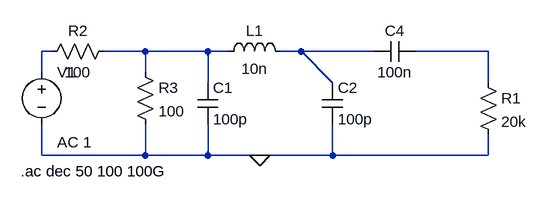
[diagram p0: schematic realim-colpits.asc]
realim-colpits.asc, the LTspice schematic file:
Version 4
SHEET 1 880 680
WIRE -112 64 -128 64
WIRE 32 64 -32 64
WIRE 128 64 32 64
WIRE 160 64 128 64
WIRE 272 64 240 64
WIRE 384 64 272 64
WIRE 560 64 448 64
WIRE -128 96 -128 64
WIRE 32 96 32 64
WIRE 128 112 128 64
WIRE 320 112 272 64
WIRE 560 112 560 64
WIRE -128 224 -128 176
WIRE 32 224 32 176
WIRE 32 224 -128 224
WIRE 128 224 128 176
WIRE 128 224 32 224
WIRE 208 224 128 224
WIRE 320 224 320 176
WIRE 320 224 208 224
WIRE 560 224 560 192
WIRE 560 224 320 224
FLAG 208 224 0
SYMBOL cap 112 112 R0
SYMATTR InstName C1
SYMATTR Value 100p
SYMBOL cap 304 112 R0
SYMATTR InstName C2
SYMATTR Value 100p
SYMBOL ind 144 80 R270
WINDOW 0 32 56 VTop 2
WINDOW 3 5 56 VBottom 2
SYMATTR InstName L1
SYMATTR Value 10n
SYMBOL voltage -128 80 R0
WINDOW 123 24 124 Left 2
WINDOW 39 0 0 Left 0
SYMATTR Value2 AC 1
SYMATTR InstName V1
SYMATTR Value ""
SYMBOL cap 448 48 R90
WINDOW 0 0 32 VBottom 2
WINDOW 3 32 32 VTop 2
SYMATTR InstName C4
SYMATTR Value 100n
SYMBOL res 544 96 R0
SYMATTR InstName R1
SYMATTR Value 20k
SYMBOL res -16 48 R90
WINDOW 0 0 56 VBottom 2
WINDOW 3 32 56 VTop 2
SYMATTR InstName R2
SYMATTR Value 100
SYMBOL res 16 80 R0
SYMATTR InstName R3
SYMATTR Value 100
TEXT -160 248 Left 2 !.ac dec 50 100 100G

The netlist it stands for:
* realim-colpits.asc
C1 N002 0 100p
C2 N003 0 100p
L1 N002 N003 10n
V1 N001 0 AC 1
C4 N004 N003 100n
R1 N004 0 20k
R2 N002 N001 100
R3 N002 0 100
.ac dec 50 100 100G
.backanno
.end